# EAGLE design Quadcopter (EAGLE 5.10)

## Sheet 1 of 4
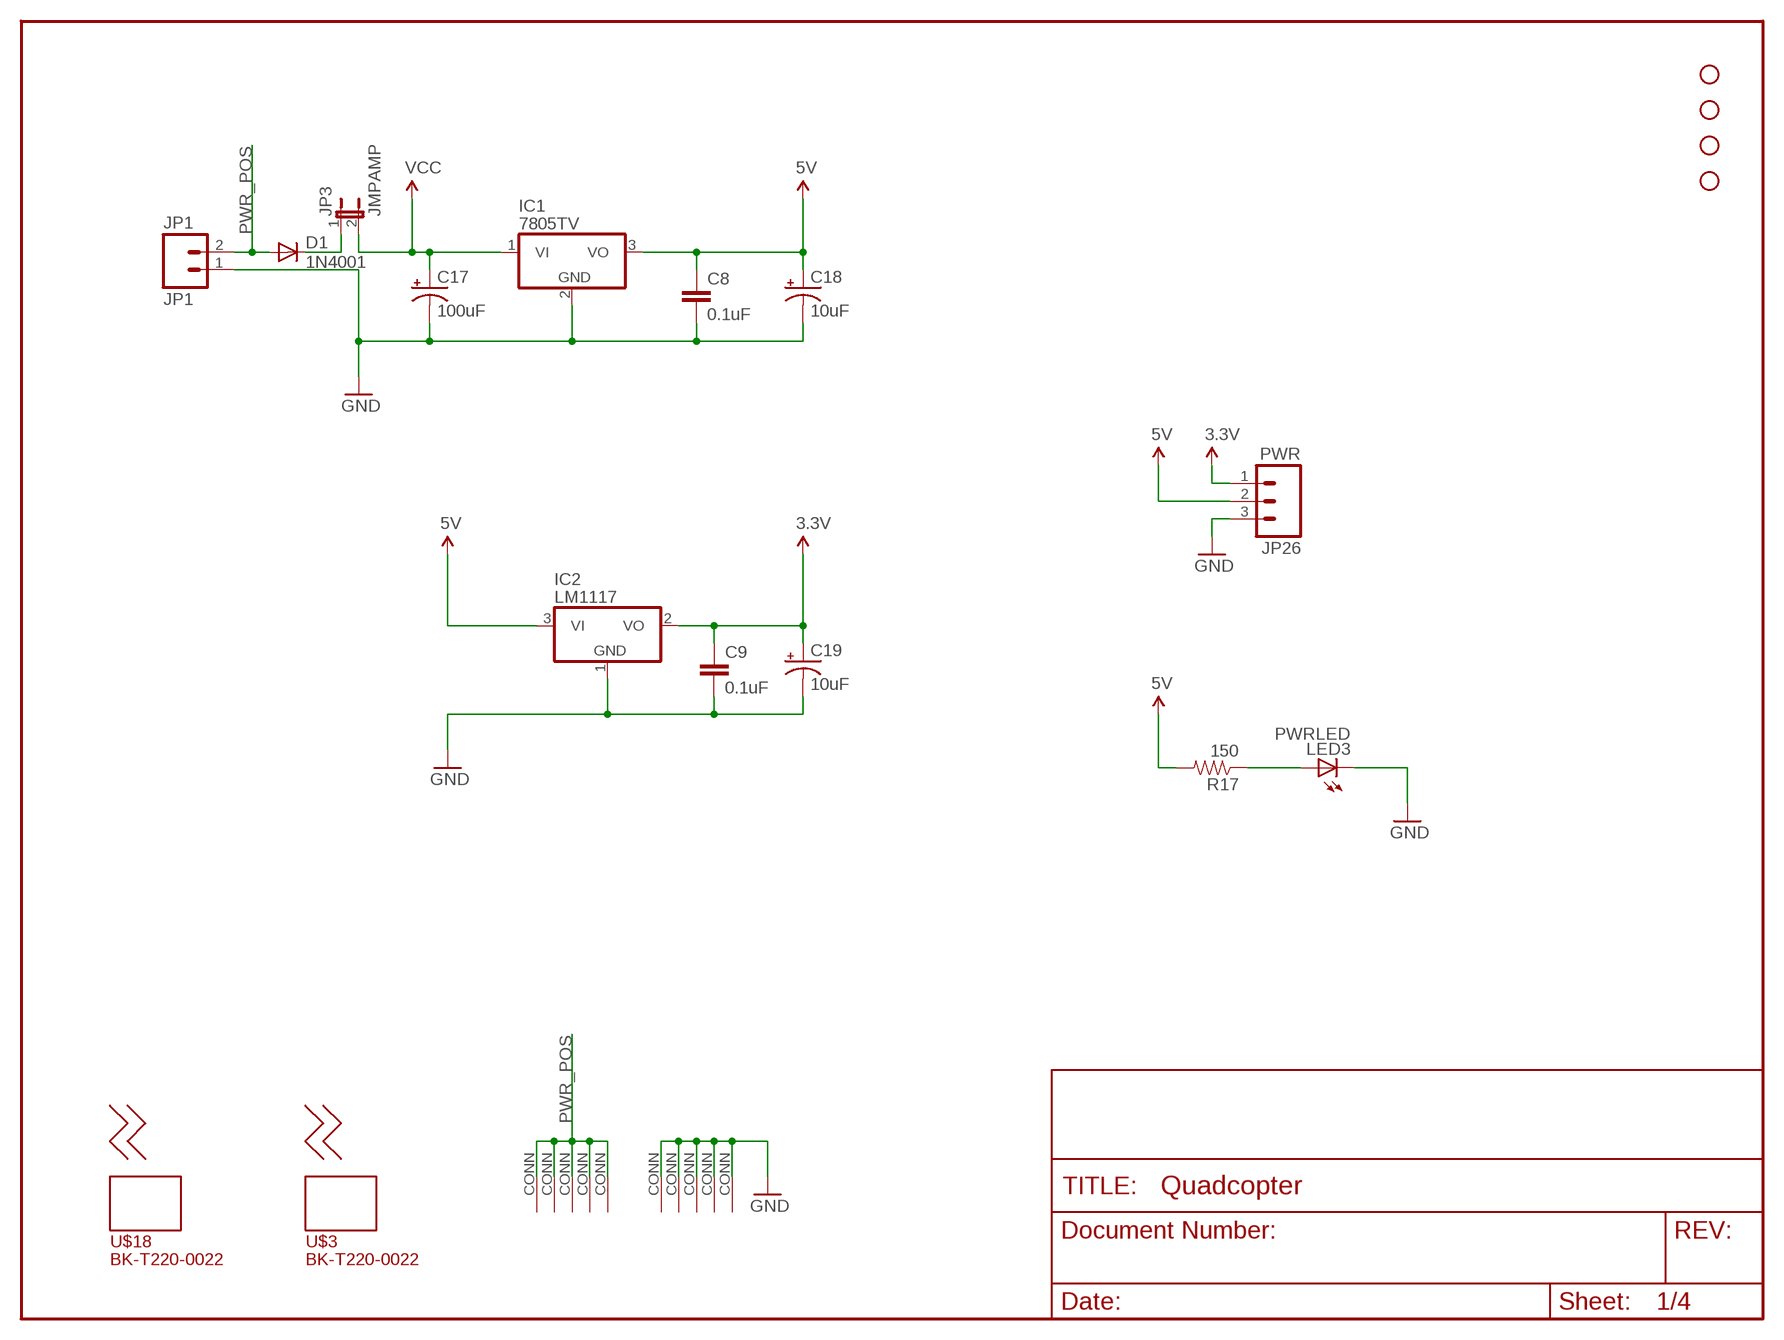
[diagram p0: schematic, sheet 1]

### Parts
C8  0.1uF  CAP1206  [1206]
C9  0.1uF  CAP1206  [1206]
C17  100uF  CPOL-USE5-8.5  [E5-8,5]
C18  10uF  CPOL-USE2-4  [E2-4]
C19  10uF  CPOL-USE2-4  [E2-4]
D1  1N4001  DIODEPTH  [DIODE-1N4001]
IC1  7805TV  [TO220V]
IC2  LM1117  [TO220V]
JP1  JP1  M023.5MM  [SCREWTERMINAL-3.5MM-2]
JP3  JMPAMP  JUMPER-2PTH  [1X02]
JP22  STAND-OFF  [STAND-OFF]
JP23  STAND-OFF  [STAND-OFF]
JP24  STAND-OFF  [STAND-OFF]
JP25  STAND-OFF  [STAND-OFF]
JP26  PWR  M03PTH  [1X03]
LED3  PWRLED  LED1206  [LED-1206]
R17  150  RESISTOR1206  [1206]
U$3  BK-T220-0022  [BK-T220-0022]
U$7  SOLDERPAD  [SOLDERPAD_3MM]
U$8  SOLDERPAD  [SOLDERPAD_3MM]
U$9  SOLDERPAD  [SOLDERPAD_3MM]
U$10  SOLDERPAD  [SOLDERPAD_3MM]
U$11  SOLDERPAD  [SOLDERPAD_3MM]
U$18  BK-T220-0022  [BK-T220-0022]
U$20  SOLDERPAD  [SOLDERPAD_3MM]
U$21  SOLDERPAD  [SOLDERPAD_3MM]
U$22  SOLDERPAD  [SOLDERPAD_3MM]
U$23  SOLDERPAD  [SOLDERPAD_3MM]
U$24  SOLDERPAD  [SOLDERPAD_3MM]

### Nets
3.3V: C9.1 C19.+ IC2.2(VO) JP26.1 ; also sheet 2,3,4
5V: C8.1 C18.+ IC1.3(VO) IC2.3(VI) JP26.2 R17.2 ; also sheet 2,3
GND: C8.2 C9.2 C17.- C18.- C19.- IC1.2(GND) IC2.1(GND) JP1.1 JP26.3 LED3.C U$20.CONN U$21.CONN U$22.CONN U$23.CONN U$24.CONN ; also sheet 2,3,4
N$10: D1.C JP3.1
N$28: LED3.A R17.1
PWR_POS: D1.A JP1.2 U$7.CONN U$8.CONN U$9.CONN U$10.CONN U$11.CONN
VCC: C17.+ IC1.1(VI) JP3.2 ; also sheet 2

## Sheet 2 of 4
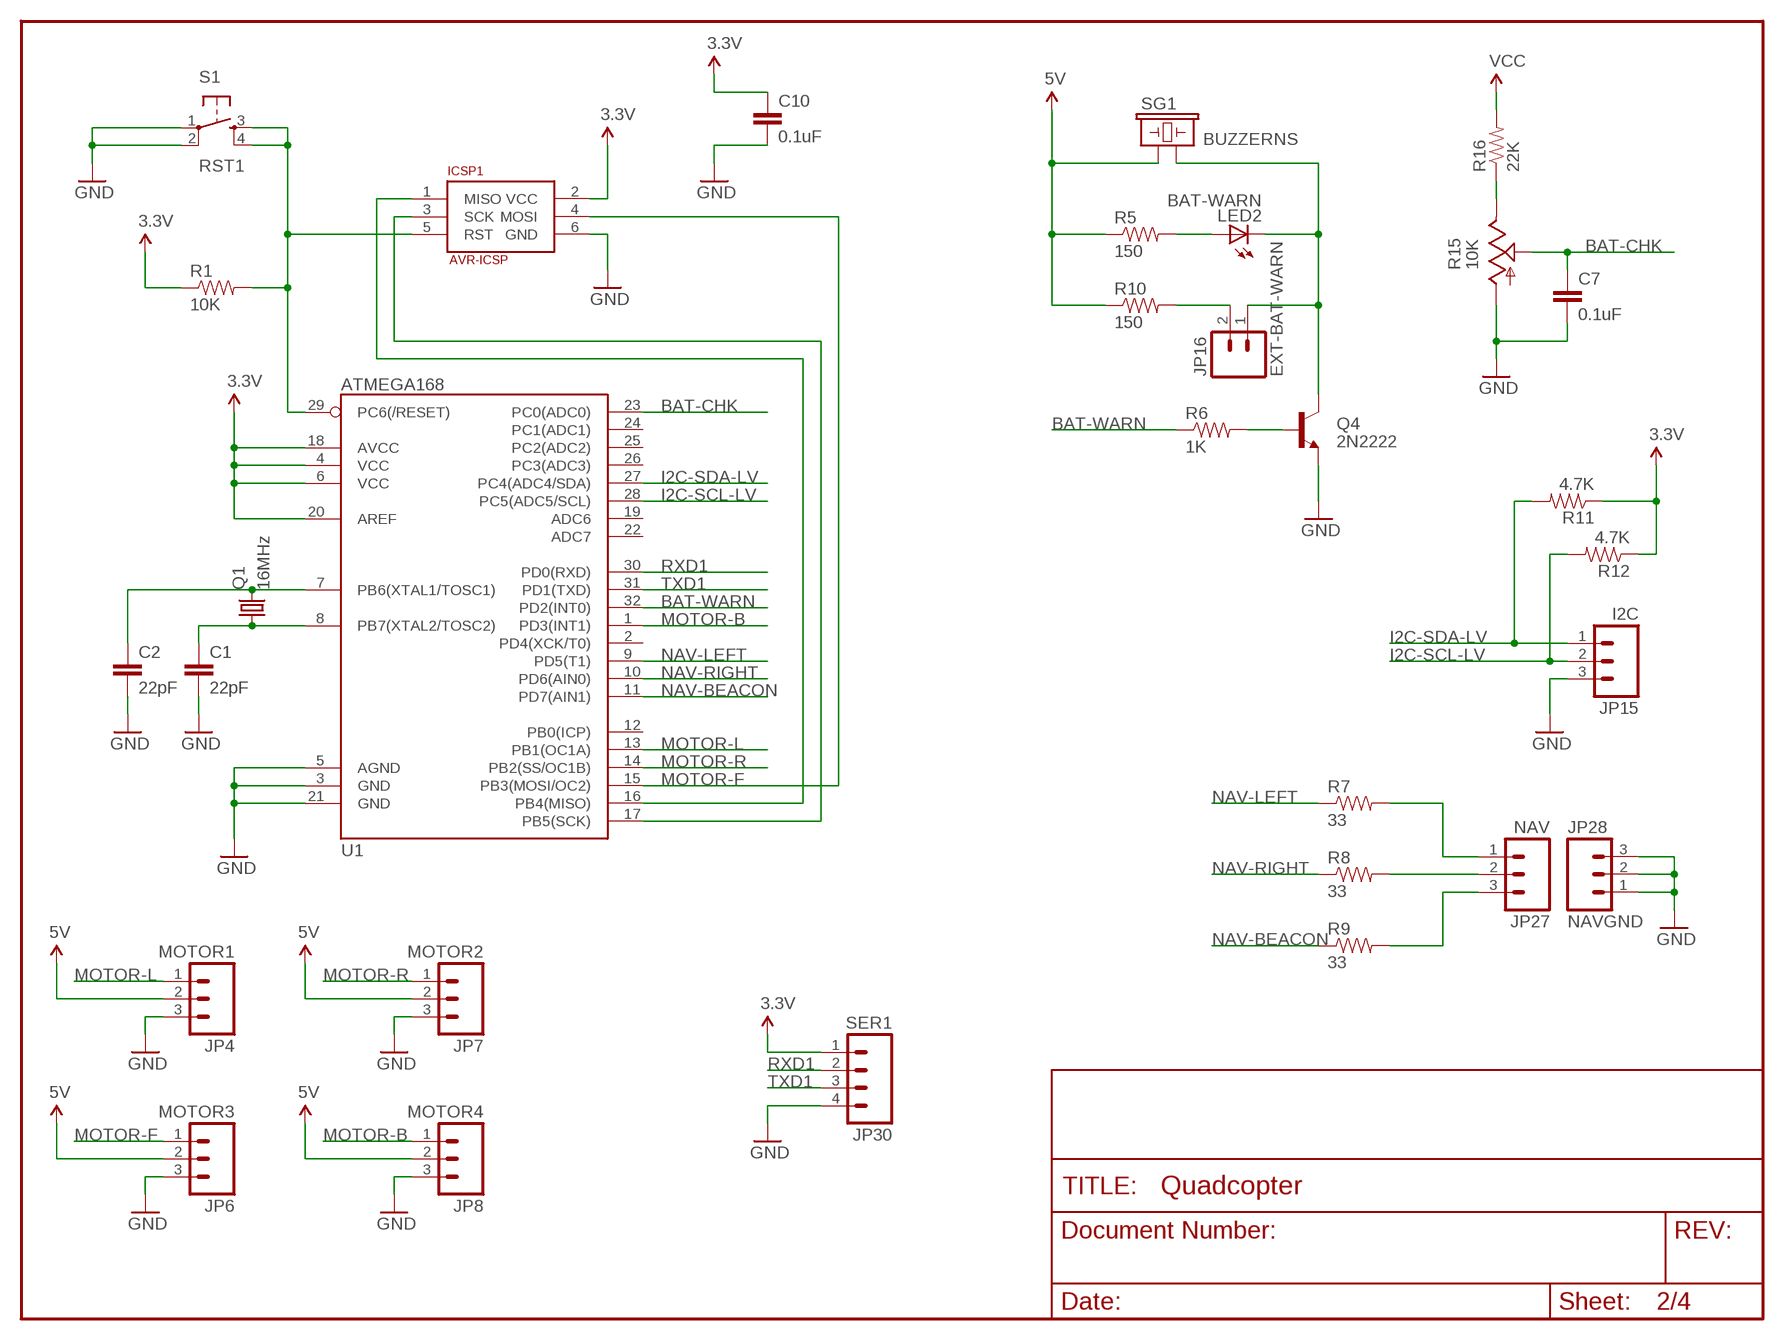
[diagram p1: schematic, sheet 2]

### Parts
C1  22pF  CAP1206  [1206]
C2  22pF  CAP1206  [1206]
C7  0.1uF  CAP1206  [1206]
C10  0.1uF  CAP1206  [1206]
ICSP1  AVR-ICSP  [AVR-ICSP]
JP4  MOTOR1  M03PTH  [1X03]
JP6  MOTOR3  M03PTH  [1X03]
JP7  MOTOR2  M03PTH  [1X03]
JP8  MOTOR4  M03PTH  [1X03]
JP15  I2C  M03PTH  [1X03]
JP16  EXT-BAT-WARN  M02PTH  [1X02]
JP27  NAV  M03PTH  [1X03]
JP28  NAVGND  M03PTH  [1X03]
JP30  SER1  M04PTH  [1X04]
LED2  BAT-WARN  LED1206  [LED-1206]
Q1  16MHz  CRYSTALHC49US  [HC49US]
Q4  2N2222  TRANSISTOR_NPNTO92  [TO-92]
R1  10K  RESISTOR1206  [1206]
R5  150  RESISTOR1206  [1206]
R6  1K  RESISTOR1206  [1206]
R7  33  RESISTOR1206  [1206]
R8  33  RESISTOR1206  [1206]
R9  33  RESISTOR1206  [1206]
R10  150  RESISTOR1206  [1206]
R11  4.7K  RESISTOR1206  [1206]
R12  4.7K  RESISTOR1206  [1206]
R15  10K  TRIM_US-B64Y  [B64Y]
R16  22K  RESISTOR1206  [1206]
S1  RST1  TAC_SWITCHPTH  [TACTILE-PTH]
SG1  BUZZERNS  [BUZZER-12MM-NS]
U1  ATMEGA168  [TQFP32-08]

### Nets
3.3V: C10.1 ICSP1.2(VCC) JP30.1 R1.1 R11.1 R12.1 U1.4(VCC) U1.6(VCC) U1.18(AVCC) U1.20(AREF) ; also sheet 1,3,4
5V: JP4.2 JP6.2 JP7.2 JP8.2 R5.1 R10.1 SG1.+ ; also sheet 1,3
BAT-CHK: C7.1 R15.S U1.23(PC0(ADC0))
BAT-WARN: R6.1 U1.32(PD2(INT0))
GND: C1.2 C2.2 C7.2 C10.2 ICSP1.6(GND) JP4.3 JP6.3 JP7.3 JP8.3 JP15.3 JP28.1 JP28.2 JP28.3 JP30.4 Q4.1(E) R15.A S1.1 S1.2 U1.3(GND) U1.5(AGND) U1.21(GND) ; also sheet 1,3,4
I2C-SCL-LV: JP15.2 R12.2 U1.28(PC5(ADC5/SCL)) ; also sheet 3,4
I2C-SDA-LV: JP15.1 R11.2 U1.27(PC4(ADC4/SDA)) ; also sheet 3,4
MOTOR-B: JP8.1 U1.1(PD3(INT1))
MOTOR-F: ICSP1.4(MOSI) JP6.1 U1.15(PB3(MOSI/OC2))
MOTOR-L: JP4.1 U1.13(PB1(OC1A))
MOTOR-R: JP7.1 U1.14(PB2(SS/OC1B))
N$1: ICSP1.5(RST) R1.2 S1.3 S1.4 U1.29(PC6(/RESET))
N$8: ICSP1.1(MISO) U1.16(PB4(MISO))
N$9: ICSP1.3(SCK) U1.17(PB5(SCK))
N$14: C2.1 Q1.2 U1.7(PB6(XTAL1/TOSC1))
N$15: C1.1 Q1.1 U1.8(PB7(XTAL2/TOSC2))
N$20: JP16.1 LED2.C Q4.3(C) SG1.-
N$21: Q4.2(B) R6.2
N$22: LED2.A R5.2
N$23: JP27.1 R7.2
N$24: JP27.2 R8.2
N$25: JP27.3 R9.2
N$26: JP16.2 R10.2
N$27: R15.E R16.1
NAV-BEACON: R9.1 U1.11(PD7(AIN1))
NAV-LEFT: R7.1 U1.9(PD5(T1))
NAV-RIGHT: R8.1 U1.10(PD6(AIN0))
RXD1: JP30.2 U1.30(PD0(RXD))
TXD1: JP30.3 U1.31(PD1(TXD))
VCC: R16.2 ; also sheet 1
Unconnected: U1.2(PD4(XCK/T0)) U1.12(PB0(ICP)) U1.19(ADC6) U1.22(ADC7) U1.24(PC1(ADC1)) U1.25(PC2(ADC2)) U1.26(PC3(ADC3))

## Sheet 3 of 4
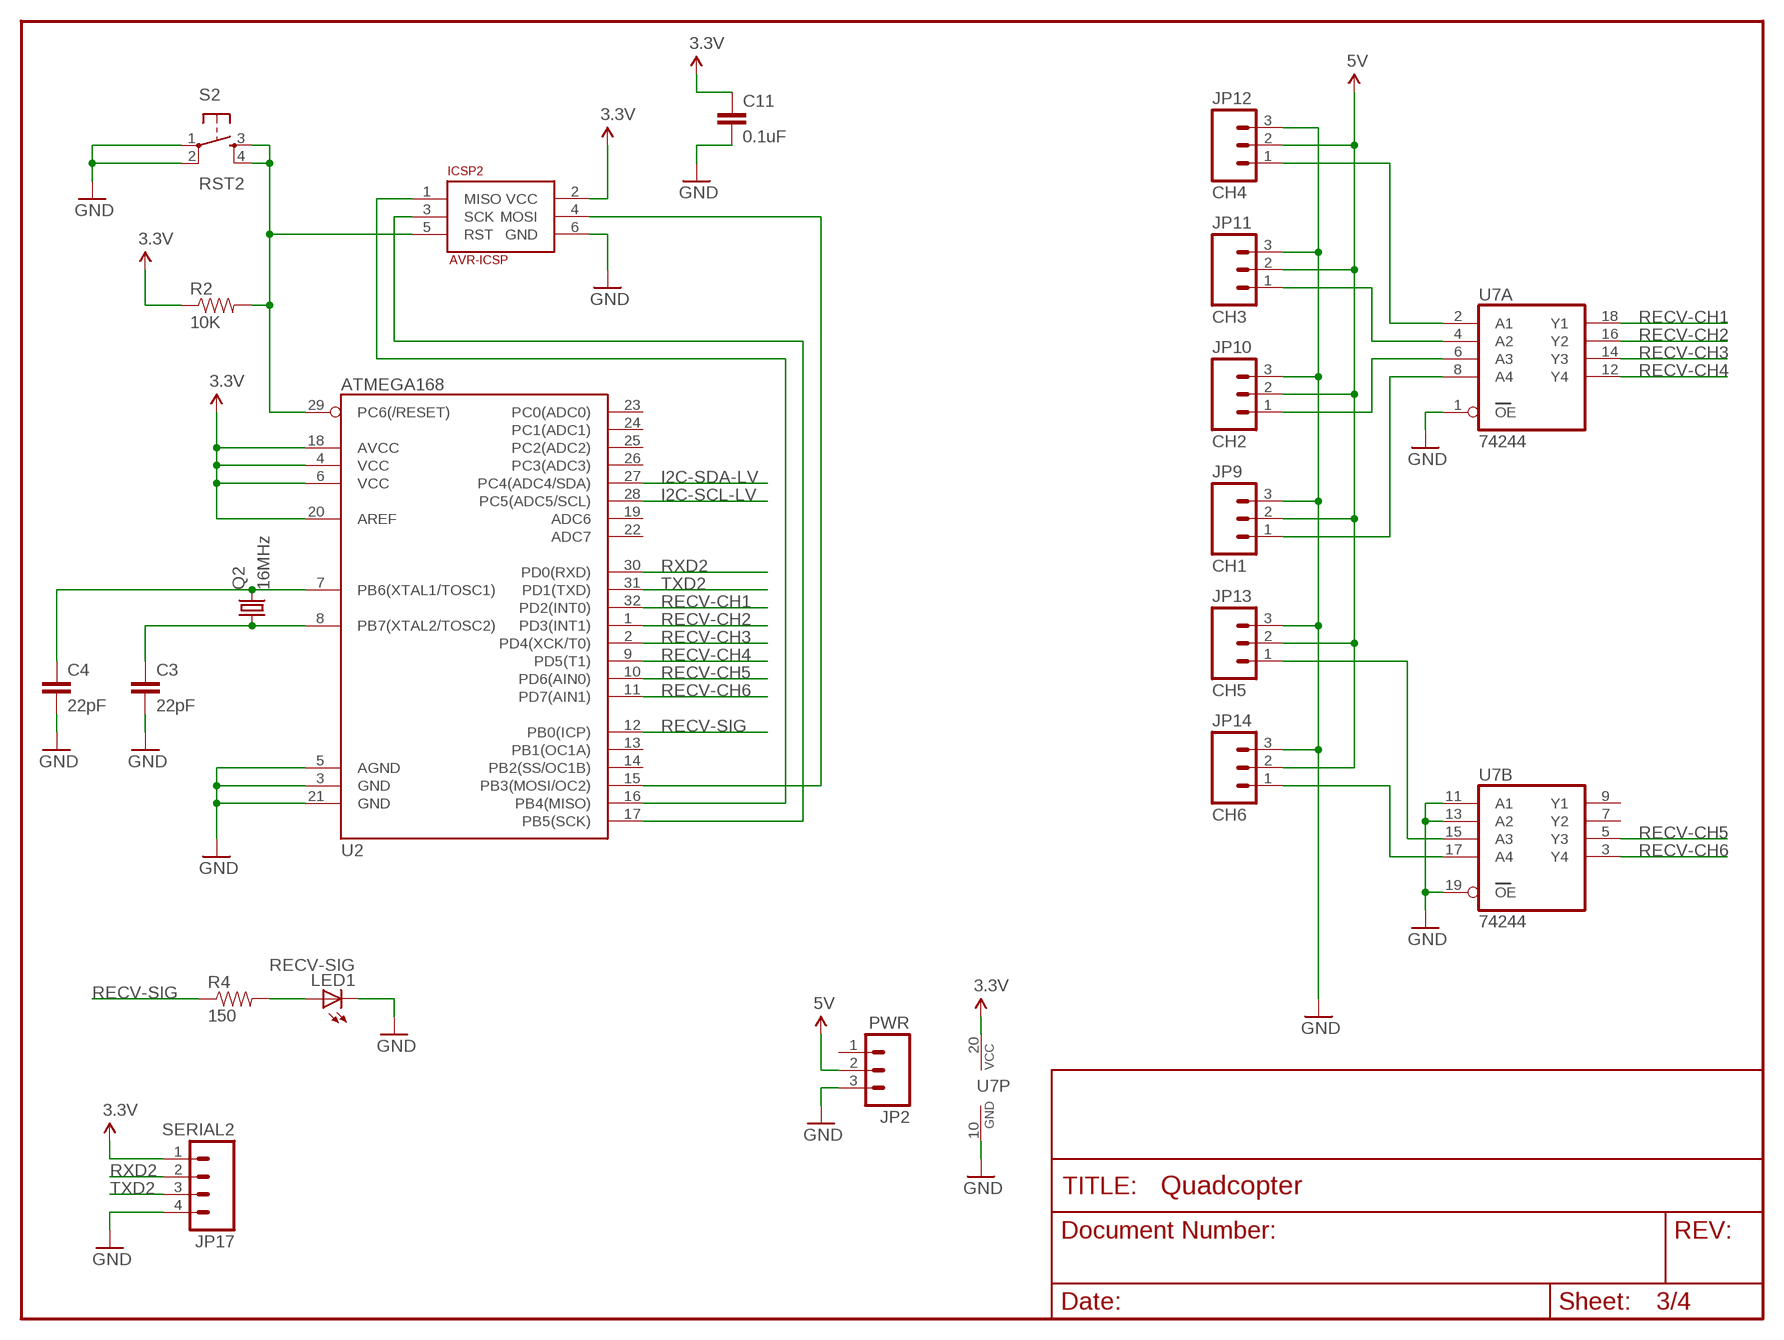
[diagram p2: schematic, sheet 3]

### Parts
C3  22pF  CAP1206  [1206]
C4  22pF  CAP1206  [1206]
C11  0.1uF  CAP1206  [1206]
ICSP2  AVR-ICSP  [AVR-ICSP]
JP2  PWR  M03PTH  [1X03]
JP9  CH1  M03PTH  [1X03]
JP10  CH2  M03PTH  [1X03]
JP11  CH3  M03PTH  [1X03]
JP12  CH4  M03PTH  [1X03]
JP13  CH5  M03PTH  [1X03]
JP14  CH6  M03PTH  [1X03]
JP17  SERIAL2  M04PTH  [1X04]
LED1  RECV-SIG  LED1206  [LED-1206]
Q2  16MHz  CRYSTALHC49US  [HC49US]
R2  10K  RESISTOR1206  [1206]
R4  150  RESISTOR1206  [1206]
S2  RST2  TAC_SWITCHPTH  [TACTILE-PTH]
U2  ATMEGA168  [TQFP32-08]
U7  74244  [TSSOP20]

### Nets
3.3V: C11.1 ICSP2.2(VCC) JP17.1 R2.1 U2.4(VCC) U2.6(VCC) U2.18(AVCC) U2.20(AREF) U7.20(P:VCC) ; also sheet 1,2,4
5V: JP2.2 JP9.2 JP10.2 JP11.2 JP12.2 JP13.2 JP14.2 ; also sheet 1,2
GND: C3.2 C4.2 C11.2 ICSP2.6(GND) JP2.3 JP9.3 JP10.3 JP11.3 JP12.3 JP13.3 JP14.3 JP17.4 LED1.C S2.1 S2.2 U2.3(GND) U2.5(AGND) U2.21(GND) U7.1(A:OE) U7.10(P:GND) U7.11(B:A1) U7.13(B:A2) U7.19(B:OE) ; also sheet 1,2,4
I2C-SCL-LV: U2.28(PC5(ADC5/SCL)) ; also sheet 2,4
I2C-SDA-LV: U2.27(PC4(ADC4/SDA)) ; also sheet 2,4
N$2: ICSP2.5(RST) R2.2 S2.3 S2.4 U2.29(PC6(/RESET))
N$6: ICSP2.1(MISO) U2.16(PB4(MISO))
N$7: ICSP2.3(SCK) U2.17(PB5(SCK))
N$11: ICSP2.4(MOSI) U2.15(PB3(MOSI/OC2))
N$13: LED1.A R4.2
N$16: C4.1 Q2.2 U2.7(PB6(XTAL1/TOSC1))
N$17: C3.1 Q2.1 U2.8(PB7(XTAL2/TOSC2))
N$29: JP9.1 U7.8(A:A4)
N$30: JP10.1 U7.6(A:A3)
N$31: JP11.1 U7.4(A:A2)
N$32: JP12.1 U7.2(A:A1)
N$33: JP13.1 U7.15(B:A3)
N$34: JP14.1 U7.17(B:A4)
RECV-CH1: U2.32(PD2(INT0)) U7.18(A:Y1)
RECV-CH2: U2.1(PD3(INT1)) U7.16(A:Y2)
RECV-CH3: U2.2(PD4(XCK/T0)) U7.14(A:Y3)
RECV-CH4: U2.9(PD5(T1)) U7.12(A:Y4)
RECV-CH5: U2.10(PD6(AIN0)) U7.5(B:Y3)
RECV-CH6: U2.11(PD7(AIN1)) U7.3(B:Y4)
RECV-SIG: R4.1 U2.12(PB0(ICP))
RXD2: JP17.2 U2.30(PD0(RXD))
TXD2: JP17.3 U2.31(PD1(TXD))
Unconnected: JP2.1 U2.13(PB1(OC1A)) U2.14(PB2(SS/OC1B)) U2.19(ADC6) U2.22(ADC7) U2.23(PC0(ADC0)) U2.24(PC1(ADC1)) U2.25(PC2(ADC2)) U2.26(PC3(ADC3)) U7.7(B:Y2) U7.9(B:Y1)

## Sheet 4 of 4
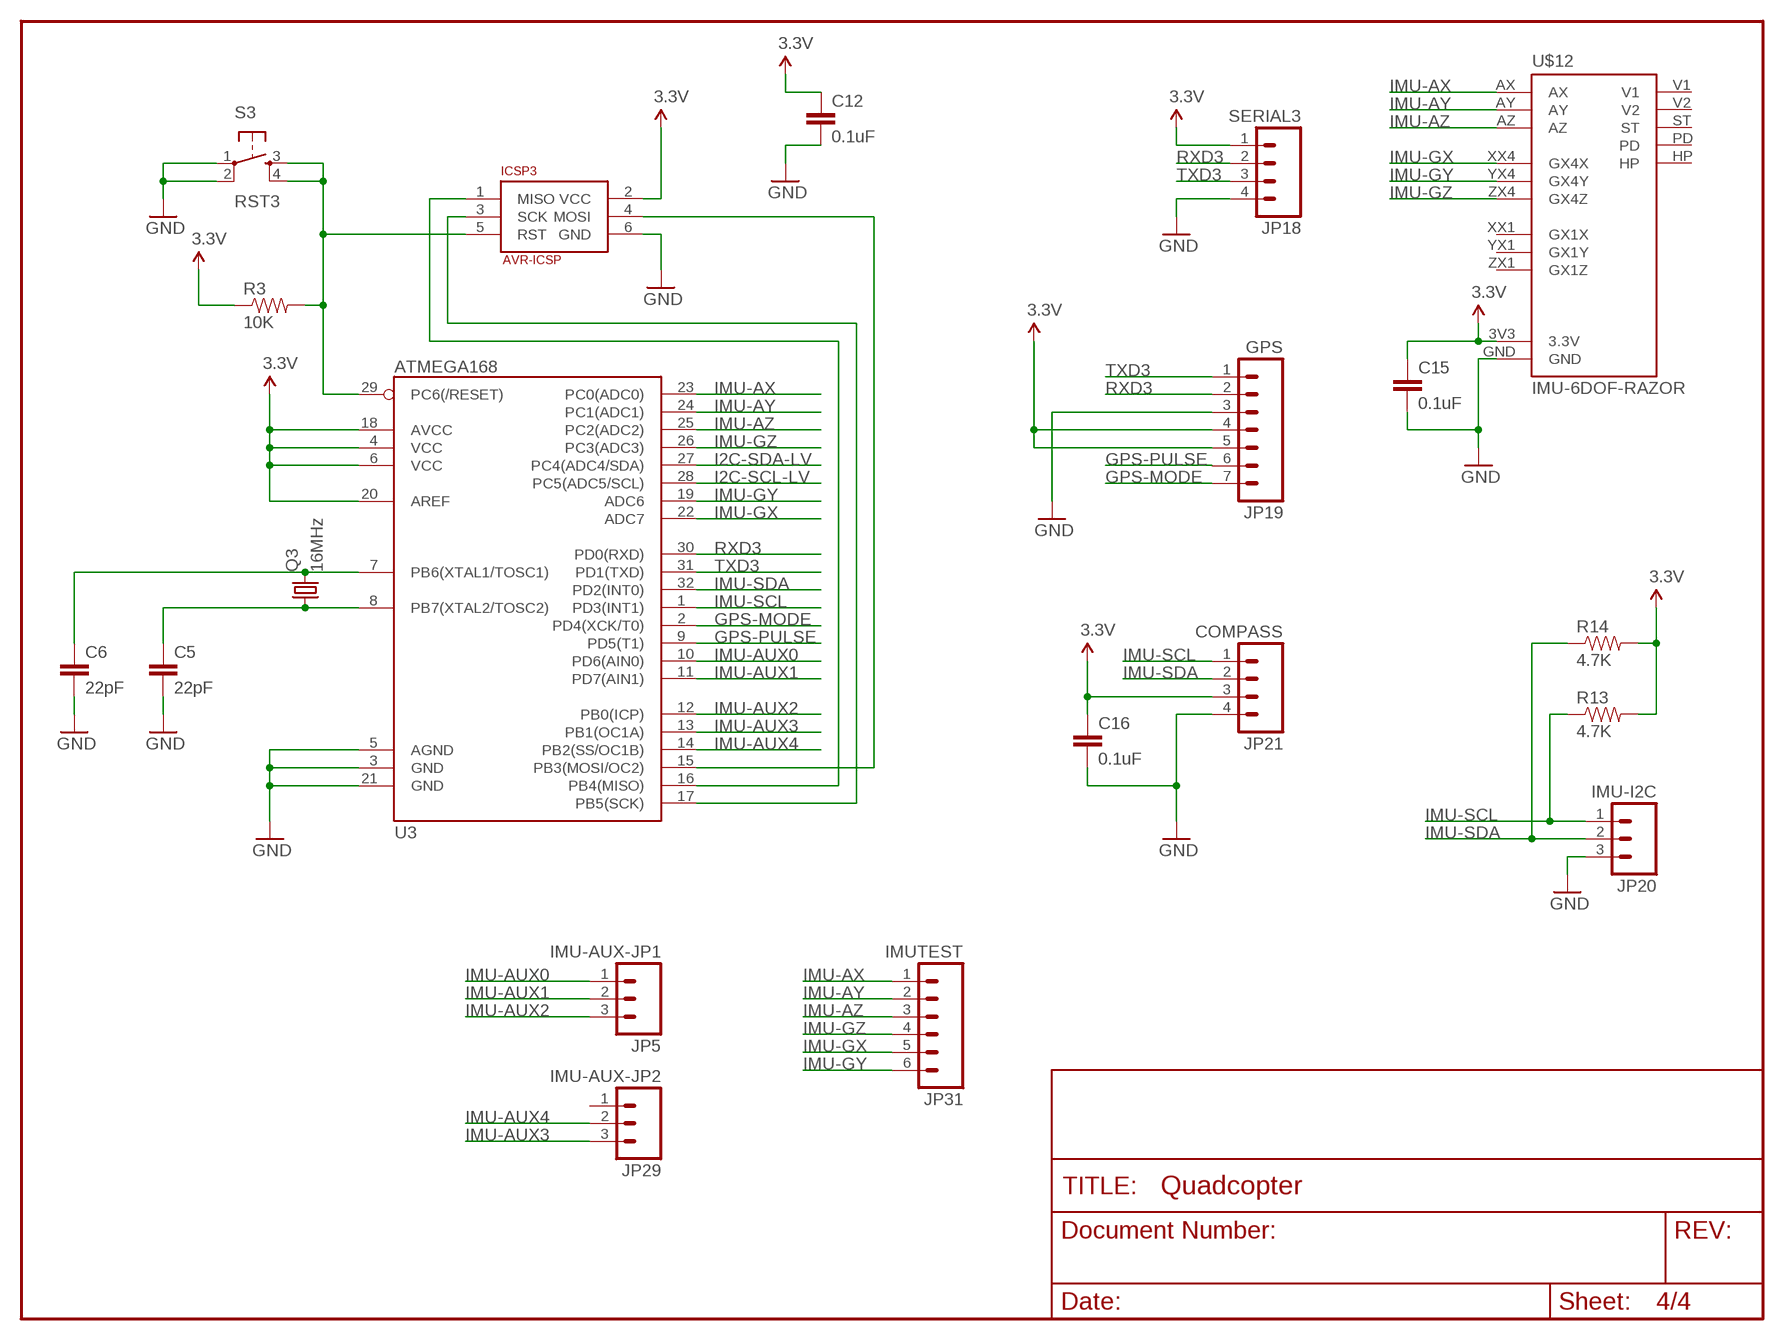
[diagram p3: schematic, sheet 4]

### Parts
C5  22pF  CAP1206  [1206]
C6  22pF  CAP1206  [1206]
C12  0.1uF  CAP1206  [1206]
C15  0.1uF  CAP1206  [1206]
C16  0.1uF  CAP1206  [1206]
ICSP3  AVR-ICSP  [AVR-ICSP]
JP5  IMU-AUX-JP1  M03PTH  [1X03]
JP18  SERIAL3  M04PTH  [1X04]
JP19  GPS  M07  [1X07]
JP20  IMU-I2C  M03PTH  [1X03]
JP21  COMPASS  M04PTH  [1X04]
JP29  IMU-AUX-JP2  M03PTH  [1X03]
JP31  IMUTEST  M06SIP  [1X06]
Q3  16MHz  CRYSTALHC49US  [HC49US]
R3  10K  RESISTOR1206  [1206]
R13  4.7K  RESISTOR1206  [1206]
R14  4.7K  RESISTOR1206  [1206]
S3  RST3  TAC_SWITCHPTH  [TACTILE-PTH]
U3  ATMEGA168  [TQFP32-08]
U$12  IMU-6DOF-RAZOR  [IMU-6DOF-RAZOR]

### Nets
3.3V: C12.1 C15.1 C16.1 ICSP3.2(VCC) JP18.1 JP19.4 JP19.5 JP21.3 R3.1 R13.2 R14.2 U3.4(VCC) U3.6(VCC) U3.18(AVCC) U3.20(AREF) U$12.3V3(3.3V) ; also sheet 1,2,3
GND: C5.2 C6.2 C12.2 C15.2 C16.2 ICSP3.6(GND) JP18.4 JP19.3 JP20.3 JP21.4 S3.1 S3.2 U3.3(GND) U3.5(AGND) U3.21(GND) U$12.GND ; also sheet 1,2,3
GPS-MODE: JP19.7 U3.2(PD4(XCK/T0))
GPS-PULSE: JP19.6 U3.9(PD5(T1))
I2C-SCL-LV: U3.28(PC5(ADC5/SCL)) ; also sheet 2,3
I2C-SDA-LV: U3.27(PC4(ADC4/SDA)) ; also sheet 2,3
IMU-AUX0: JP5.1 U3.10(PD6(AIN0))
IMU-AUX1: JP5.2 U3.11(PD7(AIN1))
IMU-AUX2: JP5.3 U3.12(PB0(ICP))
IMU-AUX3: JP29.3 U3.13(PB1(OC1A))
IMU-AUX4: JP29.2 U3.14(PB2(SS/OC1B))
IMU-AX: JP31.1 U3.23(PC0(ADC0)) U$12.AX
IMU-AY: JP31.2 U3.24(PC1(ADC1)) U$12.AY
IMU-AZ: JP31.3 U3.25(PC2(ADC2)) U$12.AZ
IMU-GX: JP31.5 U3.22(ADC7) U$12.XX4(GX4X)
IMU-GY: JP31.6 U3.19(ADC6) U$12.YX4(GX4Y)
IMU-GZ: JP31.4 U3.26(PC3(ADC3)) U$12.ZX4(GX4Z)
IMU-SCL: JP20.1 JP21.1 R13.1 U3.1(PD3(INT1))
IMU-SDA: JP20.2 JP21.2 R14.1 U3.32(PD2(INT0))
N$3: ICSP3.5(RST) R3.2 S3.3 S3.4 U3.29(PC6(/RESET))
N$4: ICSP3.1(MISO) U3.16(PB4(MISO))
N$5: ICSP3.3(SCK) U3.17(PB5(SCK))
N$12: ICSP3.4(MOSI) U3.15(PB3(MOSI/OC2))
N$18: C6.1 Q3.2 U3.7(PB6(XTAL1/TOSC1))
N$19: C5.1 Q3.1 U3.8(PB7(XTAL2/TOSC2))
RXD3: JP18.2 JP19.2 U3.30(PD0(RXD))
TXD3: JP18.3 JP19.1 U3.31(PD1(TXD))
Unconnected: JP29.1 U$12.HP U$12.PD U$12.ST U$12.V1 U$12.V2 U$12.XX1(GX1X) U$12.YX1(GX1Y) U$12.ZX1(GX1Z)

## Library data of the parts
C1-C12 C15 C16 = SparkFun:CAP: Capacitor Standard 0603 ceramic capacitor, and 0.1" leaded capacitor.
C17-C19 = rcl:CPOL-US: POLARIZED CAPACITOR, American symbol
D1 = SparkFun:DIODE: Diode These are standard reverse protection diodes and small signal diodes. SMA package can handle up to about 1A. SOD-323 can handle about 200mA. What the SOD-323 package when ordering, there are some mfgs out there that are 5-pin packages.
IC1 = linear:78*: Positive VOLTAGE REGULATOR Source: http://cache.national.com/ds/LM/LM78L05.pdf http://www.fairchildsemi.com/ds/LM/LM7805.pdf
IC2 = linear:LM1117
ICSP1-ICSP3 = Quadcopter:AVR-ICSP
JP1 JP16 = SparkFun:M02: Header 2 Standard 2-pin 0.1" header. Use with straight break away headers (SKU : PRT-00116), right angle break away headers (PRT-00553), swiss pins (PRT-00743), machine pins (PRT-00117), and female headers (PRT-00115). Molex polarized connector foot print use with SKU : PRT-08233 with associated crimp pins and housings.
JP2 JP4-JP15 JP20 JP26-JP29 = SparkFun:M03: Header 3 Standard 3-pin 0.1" header. Use with straight break away headers (SKU : PRT-00116), right angle break away headers (PRT-00553), swiss pins (PRT-00743), machine pins (PRT-00117), and female headers (PRT-00115). Molex polarized connector foot print use with SKU : PRT-08232 with associated crimp pins and housings.
JP3 = SparkFun:JUMPER-2: Jumper Basic 0.1" spaced jumper. Use with breakaway headers.
JP17 JP18 JP21 JP30 = SparkFun:M04: Header 4 Standard 4-pin 0.1" header. Use with straight break away headers (SKU : PRT-00116), right angle break away headers (PRT-00553), swiss pins (PRT-00743), machine pins (PRT-00117), and female headers (PRT-00115). Molex polarized connector foot print use with SKU : PRT-08231 with associated crimp pins and housings.
JP19 = SparkFun:M07: Header 7 Standard 7-pin 0.1" header. Use with straight break away headers (SKU : PRT-00116), right angle break away headers (PRT-00553), swiss pins (PRT-00743), machine pins (PRT-00117), and female headers (PRT-00115). NOTES ON THE VARIANTS LOCK and LOCK_LONGPADS... This footprint was designed to help hold the alignment of a through-hole component (i.e. 7-pin header) while soldering it into place. You may notice that each hole has been shifted either up or down by 0.005 of an inch from it's more standard position (which is usually a perfectly straight line). This slight alteration caused the pins (the squares in the middle) to touch the edges of the holes. Because they are alternating, it causes a "brace" to hold the header in place. 0.005 has proven to be the perfect amount of "off-center" position when using our standard breakaway headers. Although looks a little odd when you look at the bare footprint, once you have a header in there, the alteration is very hard to notice. Also, if you push a header all the way into place, it is covered up entirely on the bottom side. This idea of altering the position of holes to aid alignment will be further integrated into the Sparkfun Library for other footprints. It can help hold any component with 3 or more connection pins.
JP22-JP25 = SparkFun:STAND-OFF: Stand Off This is the mechanical footprint for a #4 phillips button head screw. Use the keepout ring to avoid running the screw head into surrounding components. SKU : PRT-00447
JP31 = SparkFun:M06: Header 6 Standard 6-pin 0.1" header. Use with straight break away headers (SKU : PRT-00116), right angle break away headers (PRT-00553), swiss pins (PRT-00743), machine pins (PRT-00117), and female headers (PRT-00115). Molex polarized connector foot print use with SKU : PRT-08094 with associated crimp pins and housings. NOTES ON THE VARIANTS LOCK and LOCK_LONGPADS... This footprint was designed to help hold the alignment of a through-hole component (i.e. 6-pin header) while soldering it into place. You may notice that each hole has been shifted either up or down by 0.005 of an inch from it's more standard position (which is a perfectly straight line). This slight alteration caused the pins (the squares in the middle) to touch the edges of the holes. Because they are alternating, it causes a "brace" to hold the component in place. 0.005 has proven to be the perfect amount of "off-center" position when using our standard breakaway headers. Although looks a little odd when you look at the bare footprint, once you have a header in there, the alteration is very hard to notice. Also, if you push a header all the way into place, it is covered up entirely on the bottom side. This idea of altering the position of holes to aid alignment will be further integrated into the Sparkfun Library for other footprints. It can help hold any component with 3 or more connection pins.
LED1-LED3 = SparkFun:LED: LEDs Standard schematic elements and footprints for 5mm, 3mm, 1206, and 0603 sized LEDs. 5mm - Spark Fun Electronics SKU : COM-00529 (and others)
Q1-Q3 = SparkFun:CRYSTAL: Crystals Various standard crystals. Proven footprints. Spark Fun Electronics SKU : COM-00534
Q4 = SparkFun:TRANSISTOR_NPN: Transistor NPN BJT configuration in SOT23 package. MMBT2222 is the common NPN we use. Double check BCE configuration again layout.
R1-R14 R16 R17 = SparkFun:RESISTOR: Resistor Basic schematic elements and footprints for 0603, 1206, and PTH 1/10th watt (small) resistors.
R15 = pot:TRIM_US-: POTENTIOMETER
S1-S3 = SparkFun:TAC_SWITCH: Momentary Switch Button commonly used for reset or general input. Spark Fun Electronics SKU : COM-00097
SG1 = SparkFun:BUZZER: Buzzer 12mm Spark Fun Electronics SKU : Comp-Buzzer
U1-U3 = SparkFun:ATMEGA168
U7 = FiveVolt:74*244
U$3 U$18 = Quadcopter:BK-T220-0022: HEATSINK, TO-220 0.75 x.38 x0.75 ,LOW PROFILE
U$7-U$11 U$20-U$24 = FiveVolt:SOLDERPAD
U$12 = Quadcopter:IMU-6DOF-RAZOR

## Board
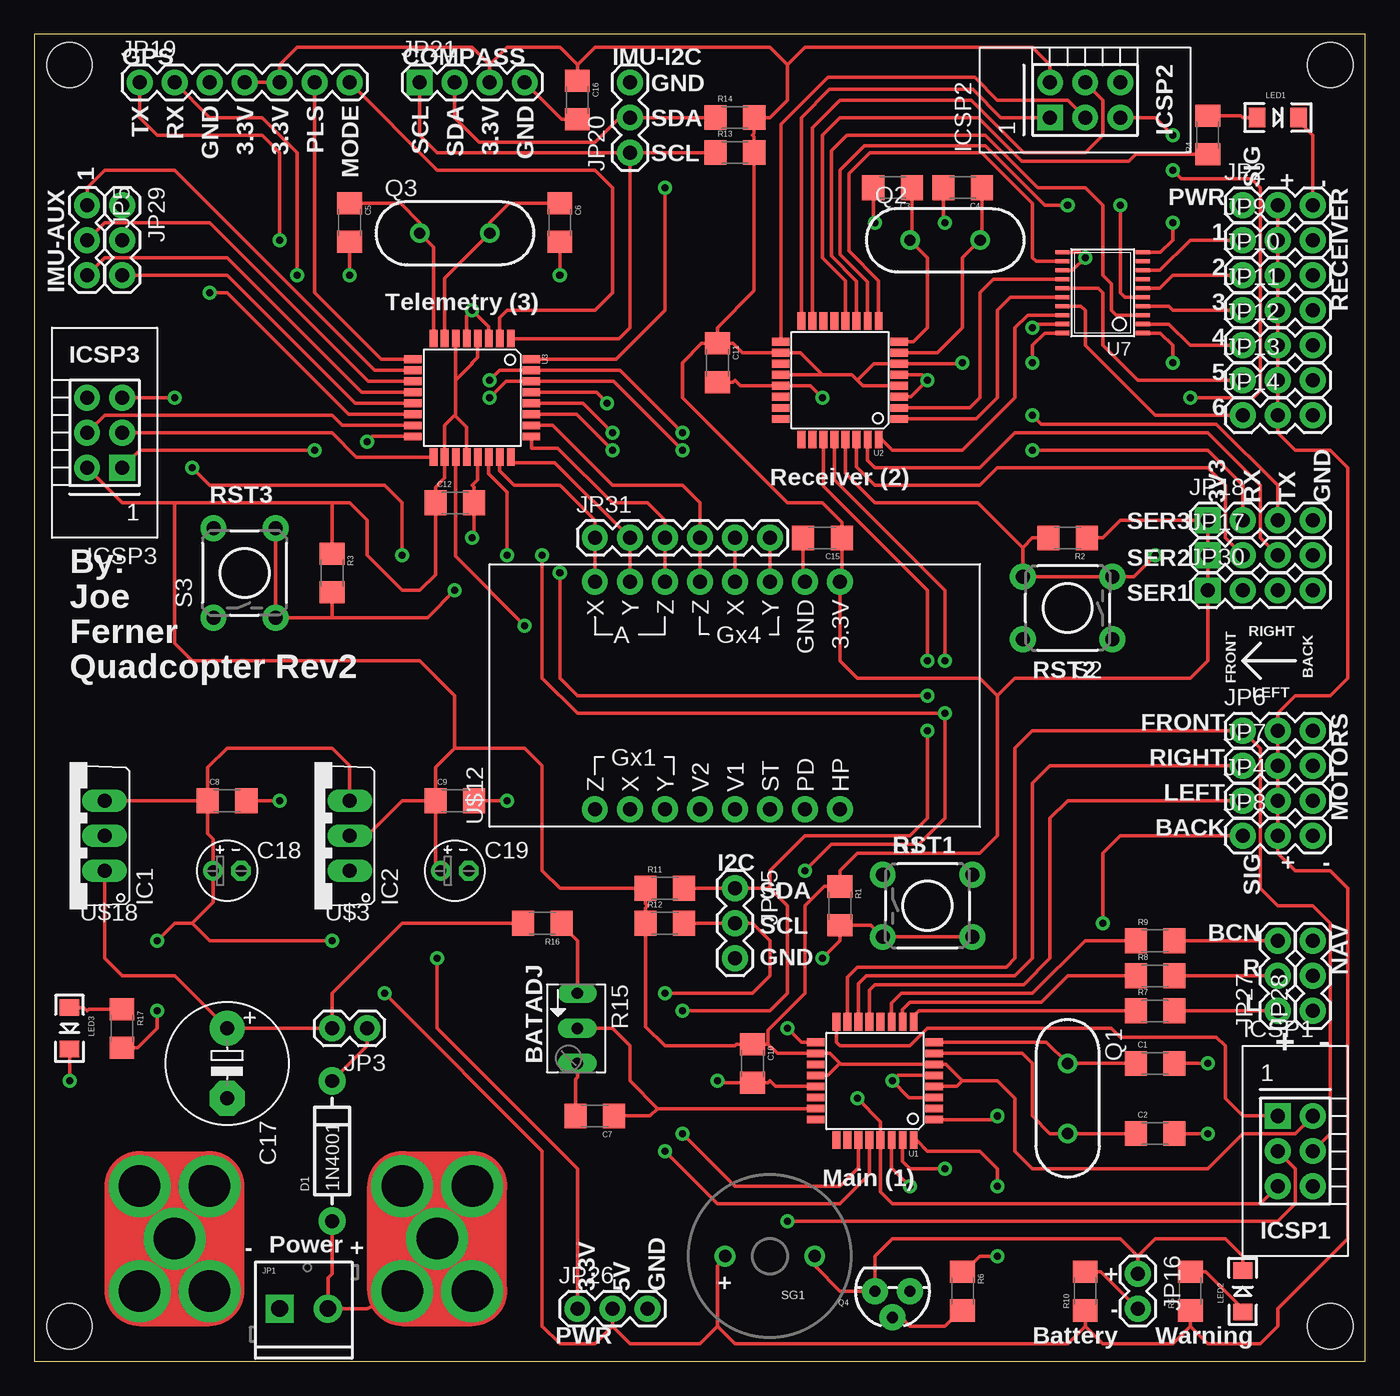
[diagram p4: board, top side]
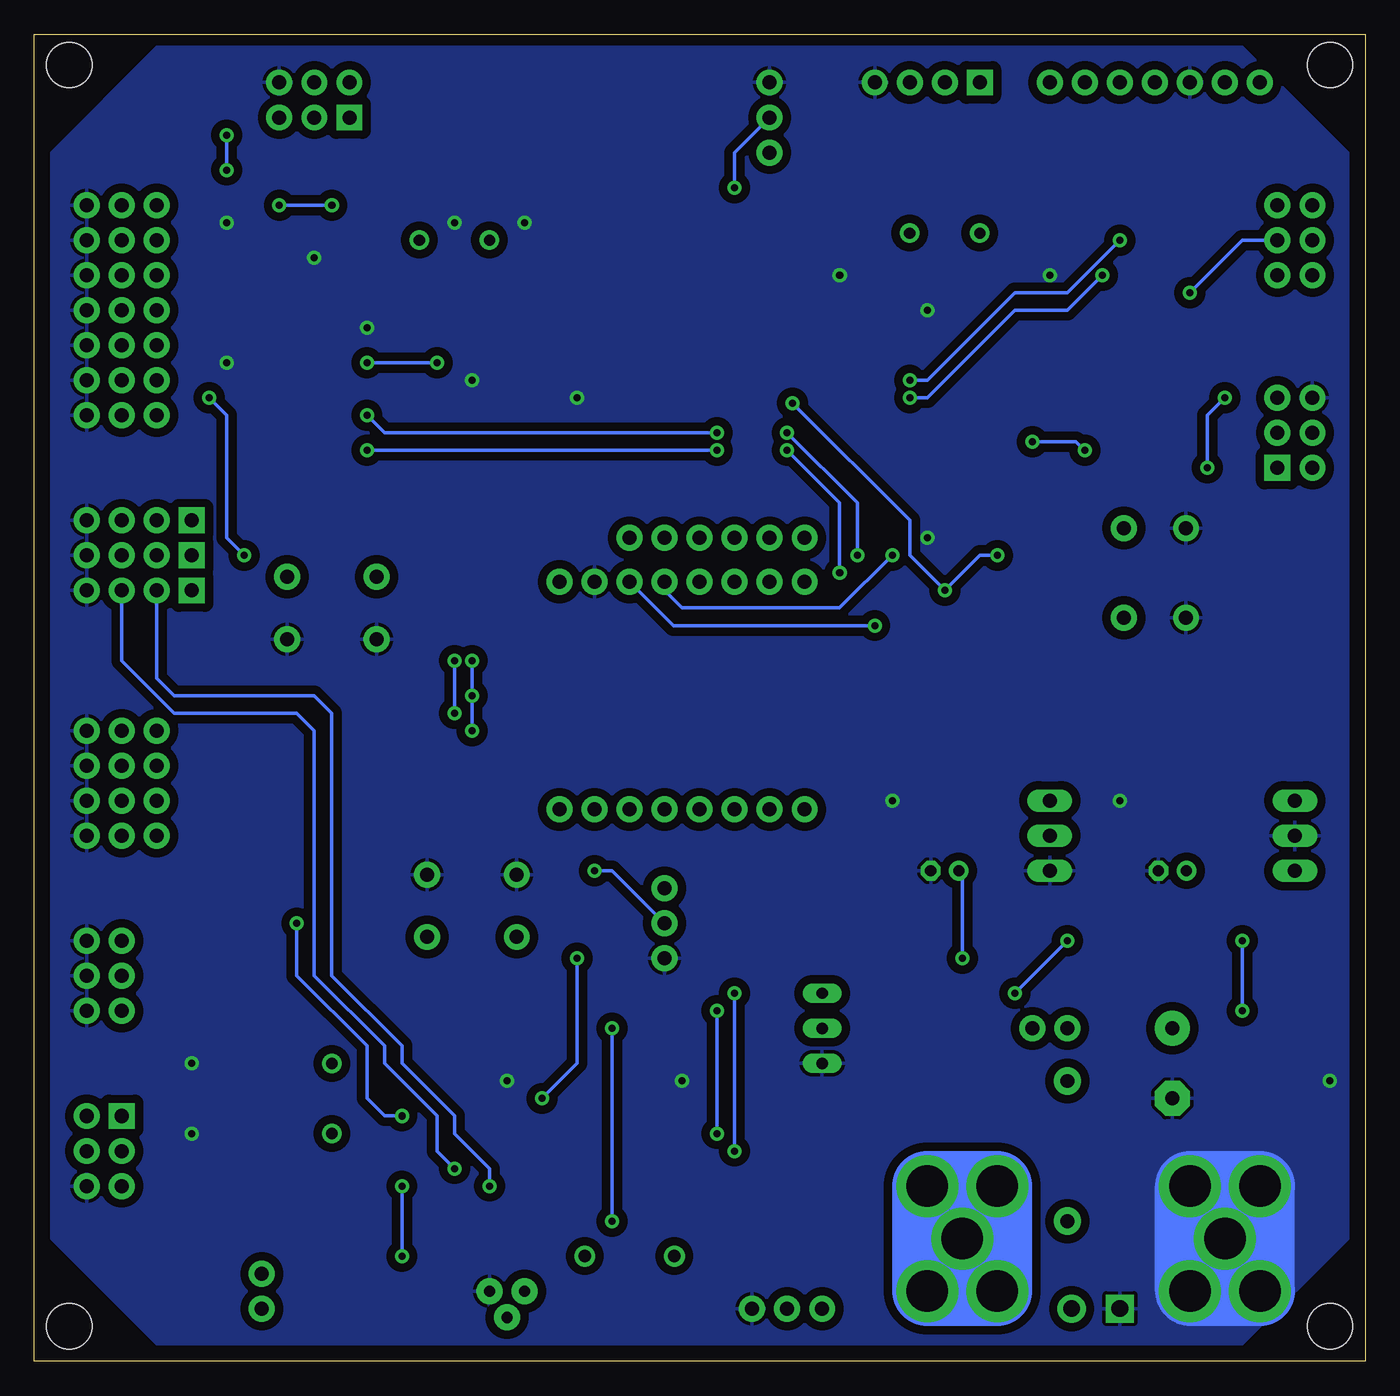
[diagram p5: board, bottom side, seen from below]

Size 96.5 x 96.19 mm. Coordinates in mm from the lower left corner, seen from the top.
Outline: 0,0 96.5,0 96.5,96.19 0,96.19 0,0
Copper layers (1*16): Top 0.035mm / dielectric 1.5mm / Bottom 0.035mm
Design rules "SparkFun": minimum track width 8mil, minimum drill 20mil, track to track 8mil, track to pad 8mil, pad to pad 8mil, via to via 8mil, smd to smd 8mil, copper to edge 10mil, drill to drill 8mil, minimum pad ring 12mil, minimum via ring 10mil, stop-mask expansion 4mil, vias tented up to drill 25mil, thermal gap 10mil

### Footprints (pad centres in the part's own frame; a part is rotated, then mirrored left to right if it is on the bottom)
1206 = smd 1.6 x 1.8: 1 -1.4,0; 2 1.4,0
E5-8,5 = drill 1.016 pad 2.54 round: + -2.54,0 | drill 1.016 pad 2.54 octagon: - 2.54,0
E2-4 = drill 0.813 pad 1.27 round: + -1.016,0 | drill 0.813 pad 1.27 octagon: - 1.016,0
DIODE-1N4001 = drill 1 pad 1.981 round: A -5.08,0; C 5.08,0
TO220V = drill 1.016 long: 1 -2.54,-2.54; 2 0,-2.54; 3 2.54,-2.54
AVR-ICSP = drill 1.016 pad 1.88 square: 1 -2.54,2.54 | drill 1.016 pad 1.88 round: 2 0,2.54; 3 -2.54,0; 4 0,0; 5 -2.54,-2.54; 6 0,-2.54
SCREWTERMINAL-3.5MM-2 = drill 1.2 pad 2.032 square: 1 0,0 | drill 1.2 pad 2.032 round: 2 3.5,0
1X03 = drill 1.016 pad 1.88 round: 1 0,0; 2 2.54,0; 3 5.08,0
1X02 = drill 1.016 pad 1.88 round: 1 0,0; 2 2.54,0
1X04 = drill 1.016 pad 1.88 square: 1 0,0 | drill 1.016 pad 1.88 round: 2 2.54,0; 3 5.08,0; 4 7.62,0
1X07 = drill 1.016 pad 1.88 round: 1 0,0; 2 2.54,0; 3 5.08,0; 4 7.62,0; 5 10.16,0; 6 12.7,0; 7 15.24,0
STAND-OFF = hole 3.302: 0,0
1X06 = drill 1.016 pad 1.88 round: 1 0,0; 2 2.54,0; 3 5.08,0; 4 7.62,0; 5 10.16,0; 6 12.7,0
LED-1206 = smd 1.2 x 1.4: A -1.5,0; C 1.5,0
HC49US = drill 0.813 round: 1 -2.54,0; 2 2.54,0
TO-92 = drill 0.813 pad 1.88 round: 1 -1.27,0; 2 0,1.905; 3 1.27,0
B64Y = drill 0.813 long: A 2.54,0; E -2.54,0; S 0,0
TACTILE-PTH = drill 1.016 pad 1.88 round: 1 -3.251,2.261; 2 3.251,2.261; 3 -3.251,-2.261; 4 3.251,-2.261
BUZZER-12MM-NS = drill 0.9 round: + 3.25,0; - -3.25,0
TQFP32-08 = smd 1.27 x 0.559: 1 -4.293,2.8; 2 -4.293,2; 3 -4.293,1.2; 4 -4.293,0.4; 5 -4.293,-0.4; 6 -4.293,-1.2; 7 -4.293,-2; 8 -4.293,-2.8; 17 4.293,-2.8; 18 4.293,-2; 19 4.293,-1.2; 20 4.293,-0.4; 21 4.293,0.4; 22 4.293,1.2; 23 4.293,2; 24 4.293,2.8 | smd 0.559 x 1.27: 9 -2.8,-4.293; 10 -2,-4.293; 11 -1.2,-4.293; 12 -0.4,-4.293; 13 0.4,-4.293; 14 1.2,-4.293; 15 2,-4.293; 16 2.8,-4.293; 25 2.8,4.293; 26 2,4.293; 27 1.2,4.293; 28 0.4,4.293; 29 -0.4,4.293; 30 -1.2,4.293; 31 -2,4.293; 32 -2.8,4.293
TSSOP20 = smd 0.305 x 0.991: 1 -2.925,-2.918; 2 -2.275,-2.918; 3 -1.625,-2.918; 4 -0.975,-2.918; 5 -0.325,-2.918; 6 0.325,-2.918; 7 0.975,-2.918; 8 1.625,-2.918; 9 2.275,-2.918; 10 2.925,-2.918; 11 2.925,2.918; 12 2.275,2.918; 13 1.625,2.918; 14 0.975,2.918; 15 0.325,2.918; 16 -0.325,2.918; 17 -0.975,2.918; 18 -1.625,2.918; 19 -2.275,2.918; 20 -2.925,2.918
SOLDERPAD_3MM = drill 3 pad 4.5 round: CONN 0,0
IMU-6DOF-RAZOR = drill 1.016 pad 1.88 round: 3V3 8.255,-8.89; AX 8.255,8.89; AY 8.255,6.35; AZ 8.255,3.81; GND 8.255,-6.35; HP -8.255,-8.89; PD -8.255,-6.35; ST -8.255,-3.81; V1 -8.255,-1.27; V2 -8.255,1.27; XX1 -8.255,6.35; XX4 8.255,-1.27; YX1 -8.255,3.81; YX4 8.255,-3.81; ZX1 -8.255,8.89; ZX4 8.255,1.27

### Placement (x,y rotation side)
C1  81.28,21.59 0 top
C2  81.28,16.51 0 top
C3  62.23,85.09 180 top
C4  67.31,85.09 180 top
C5  22.86,82.55 270 top
C6  38.1,82.55 270 top
C7  40.64,17.78 180 top
C8  13.97,40.64 0 top
C9  30.48,40.64 0 top
C10  52.07,21.59 270 top
C11  49.53,72.39 270 top
C12  30.48,62.23 0 top
C15  57.15,59.69 180 top
C16  39.37,91.44 270 top
C17  13.97,21.59 270 top
C18  13.97,35.56 0 top
C19  30.48,35.56 0 top
D1  21.59,15.24 90 top
IC1  2.54,38.1 90 top
IC2  20.32,38.1 90 top
ICSP1  92.71,15.24 0 top
ICSP2  76.2,92.71 90 top
ICSP3  3.81,67.31 180 top
JP1  17.78,3.81 0 top
JP2  87.63,83.82 0 top
JP3  24.13,24.13 180 top
JP4  87.63,40.64 0 top
JP5  3.81,83.82 270 top
JP6  87.63,45.72 0 top
JP7  87.63,43.18 0 top
JP8  87.63,38.1 0 top
JP9  87.63,81.28 0 top
JP10  87.63,78.74 0 top
JP11  87.63,76.2 0 top
JP12  87.63,73.66 0 top
JP13  87.63,71.12 0 top
JP14  87.63,68.58 0 top
JP15  50.8,34.29 270 top
JP16  80.01,6.35 270 top
JP17  85.09,58.42 0 top
JP18  85.09,60.96 0 top
JP19  7.62,92.71 0 top
JP20  43.18,87.63 90 top
JP21  27.94,92.71 0 top
JP22  2.54,2.54 0 top
JP23  93.98,2.54 0 top
JP24  93.98,93.98 0 top
JP25  2.54,93.98 0 top
JP26  39.37,3.81 0 top
JP27  90.17,25.4 90 top
JP28  92.71,25.4 90 top
JP29  6.35,83.82 270 top
JP30  85.09,55.88 0 top
JP31  40.64,59.69 0 top
LED1  90.17,90.17 0 top
LED2  87.63,5.08 90 top
LED3  2.54,24.13 270 top
Q1  74.93,19.05 270 top
Q2  66.04,81.28 0 top
Q3  30.48,81.79 0 top
Q4  62.23,5.08 180 top
R1  58.42,33.02 270 top
R2  74.93,59.69 180 top
R3  21.59,57.15 270 top
R4  85.09,88.9 90 top
R5  83.82,5.08 90 top
R6  67.31,5.08 270 top
R7  81.28,25.4 0 top
R8  81.28,27.94 0 top
R9  81.28,30.48 0 top
R10  76.2,5.08 90 top
R11  45.72,34.29 0 top
R12  45.72,31.75 0 top
R13  50.8,87.63 0 top
R14  50.8,90.17 0 top
R15  39.37,24.13 270 top
R16  36.83,31.75 180 top
R17  6.35,24.13 270 top
S1  64.77,33.02 0 top
S2  74.93,54.61 180 top
S3  15.24,57.15 90 top
SG1  53.34,7.62 180 top
U1  60.96,20.32 180 top
U2  58.42,71.12 180 top
U3  31.75,69.85 270 top
U7  77.47,77.47 90 top
U$3  19.05,27.94 0 top
U$7  29.21,8.89 180 top
U$8  26.67,12.7 180 top
U$9  26.67,5.08 180 top
U$10  31.75,5.08 180 top
U$11  31.75,12.7 180 top
U$12  49.53,48.26 90 top
U$18  1.27,27.94 0 top
U$20  10.16,8.89 0 top
U$21  7.62,5.08 0 top
U$22  12.7,12.7 0 top
U$23  7.62,12.7 0 top
U$24  12.7,5.08 0 top

### Tracks (layer width: path | path; a pad name or v marks a point on that pad's centre or on a via)
3.3V  (via drill 0.51)
  Top 0.254: C9.1 26.67,40.64 24.13,38.1 IC2.2 | C9.1 29.08,35.94 C19.+ | 53.21,22.99 C10.1 50.93,22.99 50.8,22.86 45.72,22.86 44.32,24.26 R12.1 44.32,32.89 44.45,33.02 44.32,33.15 R11.1 38.1,34.29 36.83,35.56 36.83,43.18 35.56,44.45 30.48,44.45 | 53.21,22.99 53.88,22.32 U1.18 57.69,22.32 58.42,21.59 | U1.20 57.55,20.72 58.42,21.59 | 58.42,21.59 58.49,21.52 U1.6 66.11,21.52 67.31,20.32 | U1.4 66.91,19.92 67.31,20.32 | C9.1 29.08,43.05 30.48,44.45 | 53.21,22.99 53.21,24 55.88,26.67 55.88,33.02 57.28,34.42 R1.1 58.42,35.56 59.69,36.83 68.58,36.83 69.85,38.1 69.85,48.26 | 67.31,20.32 69.85,20.32 71.12,19.05 71.12,15.24 72.39,13.97 85.09,13.97 87.63,16.51 91.44,16.51 ICSP1.2 | R2.1 77.47,59.69 78.74,60.96 JP18.1 JP17.1 JP30.1 85.09,50.8 83.82,49.53 71.12,49.53 69.85,48.26 | ICSP2.2 73.66,93.98 72.39,95.25 55.88,95.25 54.61,93.98 | 54.61,93.98 54.61,91.44 53.34,90.17 R14.2 52.2,89.03 52.07,88.9 52.2,88.77 R13.2 52.2,77.6 49.53,74.93 C11.1 | 33.02,93.98 34.29,95.25 38.1,95.25 39.37,93.98 | 54.61,93.98 53.34,95.25 40.64,95.25 39.37,93.98 | 39.37,93.98 C16.1 | 33.02,93.98 JP21.3 | 33.02,93.98 31.75,95.25 19.05,95.25 17.78,93.98 JP19.5 JP19.4 | 59.69,71.12 60.89,72.32 U2.6 67.24,72.32 v67.31,72.39 | U2.4 60.09,70.72 59.69,71.12 | 57.15,71.52 U2.20 | 57.15,71.52 59.29,71.52 59.69,71.12 | 57.15,71.52 55.55,73.12 U2.18 51.34,73.12 50.67,73.79 C11.1 | U7.20 73.28,74.55 72.39,73.66 v72.39,72.39 | C11.1 48.39,73.79 46.99,72.39 46.99,69.85 54.61,62.23 57.15,62.23 58.55,60.83 C15.1 58.55,56.65 U$12.3V3 58.42,50.8 59.69,49.53 68.58,49.53 69.85,48.26 | U3.20 31.35,67.71 30.48,68.58
  Top 0.254: 30.48,68.58 29.75,67.85 U3.18 29.75,64.04 29.08,63.37 C12.1 29.08,57.02 27.94,55.88 26.67,55.88 24.13,58.42 24.13,60.96 22.86,62.23 21.59,62.23 | 30.55,71.12 30.55,68.65 30.48,68.58 | 30.55,71.12 U3.6 | U3.4 32.15,72.79 31.75,72.39 31.75,72.32 30.55,71.12 | ICSP3.2 6.35,62.23 10.16,62.23 | 10.16,62.23 21.59,62.23 | 21.59,62.23 R3.1 | 30.48,44.45 30.48,48.26 27.94,50.8 11.43,50.8 10.16,52.07 10.16,62.23 | v29.21,29.21 29.21,24.13 39.37,13.97 JP26.1
  Bottom 0.254: v67.31,72.39 v72.39,72.39 | v29.21,29.21 29.21,35.31 C19.+
5V  (via drill 0.51)
  Top 0.254: C8.1 12.57,38.23 12.95,37.85 C18.+ 12.95,33.27 11.43,31.75 | C8.1 IC1.3 | C8.1 12.57,43.05 13.97,44.45 21.59,44.45 22.86,43.18 IC2.3 | 76.2,2.54 74.93,1.27 50.8,1.27 49.53,2.54 | 76.2,2.54 R10.1 | 76.2,2.54 77.47,1.27 82.55,1.27 83.82,2.54 | 83.82,2.54 R5.1 | 83.82,2.54 85.09,1.27 88.9,1.27 90.17,2.54 90.17,3.81 95.25,8.89 95.25,34.29 93.98,35.56 91.44,35.56 90.17,36.83 JP8.2 JP4.2 JP7.2 JP6.2 90.17,46.99 91.44,48.26 93.98,48.26 95.25,49.53 95.25,64.77 93.98,66.04 91.44,66.04 90.17,67.31 JP14.2 JP13.2 JP12.2 JP11.2 JP10.2 JP9.2 JP2.2 | 49.53,2.54 49.53,6.91 SG1.+ | 11.43,31.75 10.16,31.75 v8.89,30.48 | v8.89,25.4 8.89,24.13 7.49,22.73 R17.2 | 41.91,2.54 43.18,1.27 48.26,1.27 49.53,2.54 | 41.91,2.54 JP26.2 | 41.91,2.54 40.64,1.27 38.1,1.27 36.83,2.54 36.83,15.24 v25.4,26.67 | v21.59,30.48 12.7,30.48 11.43,31.75
  Bottom 0.254: v21.59,30.48 v25.4,26.67 | v8.89,25.4 v8.89,30.48
BAT-CHK
  Top 0.254: 45.18,18.32 U1.23 | 45.18,18.32 43.18,20.32 43.18,22.86 41.91,24.13 R15.S | C7.1 44.64,17.78 45.18,18.32
BAT-WARN  (via drill 0.51)
  Top 0.254: U1.32 63.98,16.03 64.77,15.24 68.58,15.24 69.85,13.97 v69.85,12.7 | R6.1 67.44,6.48 68.58,7.62 v69.85,7.62
  Bottom 0.254: v69.85,7.62 v69.85,12.7
GND  (via drill 0.51)
  Top 0.254: C8.2 v17.78,40.64 | C9.2 v34.29,40.64 | C1.2 v85.09,21.59 | C2.2 v85.09,16.51 | U1.21 53.74,19.92 53.34,20.32 53.21,20.19 C10.2 49.66,20.19 v49.53,20.32 | U1.5 62.63,20.72 v62.23,20.32 63.43,19.12 U1.3 | U7.1 81.67,74.55 82.55,73.66 v82.55,72.39 | U7.10 81.67,80.39 82.55,81.28 v82.55,82.55 | LED1.C 91.67,89.94 92.71,88.9 JP2.3 | C16.2 38.23,90.04 JP21.4 | C3.2 60.83,82.68 v60.96,82.55 | C4.2 65.91,82.68 v66.04,82.55 | U2.5 64.37,71.52 v64.77,71.12 63.57,69.92 U2.3 | v57.15,69.85 56.28,70.72 U2.21 51.2,70.72 50.8,71.12 50.67,70.99 C11.2 | U7.11 75.81,80.39 v76.2,80.01 75.28,79.09 U7.13 | U7.19 72.66,75.19 v72.39,74.93 | C15.2 55.75,56.65 U$12.GND | U3.5 31.35,75.8 v31.75,76.2 32.95,75 U3.3 | v31.75,59.69 31.88,59.82 C12.2 31.88,63.37 31.75,63.5 32.15,63.9 U3.21 | C5.2 v22.86,78.74 | C6.2 v38.1,78.74 | C7.2 39.24,20.45 39.37,20.58 R15.A | LED3.C v2.54,20.32
  Top 5.08: U$21.CONN U$20.CONN | U$20.CONN U$22.CONN | U$20.CONN U$23.CONN | U$20.CONN U$24.CONN | U$21.CONN U$24.CONN | U$21.CONN U$23.CONN | U$23.CONN U$22.CONN | U$24.CONN U$22.CONN
  Bottom 5.08: U$20.CONN U$23.CONN | U$20.CONN U$22.CONN | U$20.CONN U$24.CONN | U$21.CONN U$20.CONN | U$21.CONN U$24.CONN | U$24.CONN U$22.CONN | U$23.CONN U$22.CONN | U$21.CONN U$23.CONN
  pour Bottom (isolate 0.61): 1.27,87.63 8.89,95.25 87.63,95.25 95.25,87.63 95.25,8.89 87.63,1.27 8.89,1.27 1.27,8.89
GPS-MODE
  Top 0.254: U3.2 33.75,75.66 34.29,76.2 40.64,76.2 41.91,77.47 41.91,85.09 40.64,86.36 29.21,86.36 JP19.7
GPS-PULSE
  Top 0.254: U3.9 25.14,72.65 20.32,77.47 JP19.6
I2C-SCL-LV  (via drill 0.51)
  Top 0.254: U1.28 60.56,13.57 58.42,11.43 49.53,11.43 v45.72,15.24 | R12.2 JP15.2 52.07,31.75 53.34,30.48 53.34,27.94 52.07,26.67 v45.72,26.67 | U2.28 58.02,63.9 66.04,55.88 v66.04,50.8 | U3.28 39.77,69.45 v41.91,67.31 | v36.83,58.42 36.83,49.53 39.37,46.99 v66.04,46.99 66.04,39.37 64.14,37.47 57.78,37.47 v55.88,35.56
  Bottom 0.254: v45.72,15.24 v45.72,26.67 | v36.83,58.42 36.83,62.23 v41.91,67.31 | JP15.2 54.61,35.56 v55.88,35.56 | v66.04,46.99 v66.04,50.8
I2C-SDA-LV  (via drill 0.51)
  Top 0.254: U1.27 59.76,14.04 58.42,12.7 50.8,12.7 v46.99,16.51 | R11.2 JP15.1 53.34,34.29 | 53.34,34.29 54.61,33.02 54.61,26.67 53.34,25.4 v46.99,25.4 | U2.27 57.22,63.43 64.77,55.88 v64.77,50.8 | U3.27 39.3,68.65 v41.91,66.04 | v38.1,57.15 38.1,49.53 39.37,48.26 v64.77,48.26 | 53.34,34.29 53.34,35.56 55.88,38.1 63.5,38.1 64.77,39.37 v64.77,45.72
  Bottom 0.254: v46.99,16.51 v46.99,25.4 | v38.1,57.15 38.1,62.23 v41.91,66.04 | v64.77,45.72 v64.77,48.26 v64.77,50.8
IMU-AUX0
  Top 0.254: U3.10 24.67,71.85 10.16,86.36 5.08,86.36 3.81,85.09 JP5.1
IMU-AUX1
  Top 0.254: U3.11 24.2,71.05 12.7,82.55 5.08,82.55 JP5.2
IMU-AUX2
  Top 0.254: U3.12 23.73,70.25 13.97,80.01 5.08,80.01 JP5.3
IMU-AUX3
  Top 0.254: U3.13 23.26,69.45 13.97,78.74 JP29.3
IMU-AUX4  (via drill 0.51)
  Top 0.254: U3.14 22.79,68.65 13.97,77.47 v12.7,77.47
  Bottom 0.254: v12.7,77.47 8.89,81.28 JP29.2
IMU-AX
  Top 0.254: U3.23 33.75,64.55 34.8,63.5 38.1,63.5 40.64,60.96 JP31.1 U$12.AX
IMU-AY
  Top 0.254: U3.24 34.55,65.14 37.73,65.14 JP31.2 U$12.AY
IMU-AZ
  Top 0.254: U3.25 36.04,66.19 37.95,66.19 41.91,62.23 44.45,62.23 45.72,60.96 JP31.3 U$12.AZ
IMU-GX  (via drill 0.51)
  Top 0.254: U3.22 32.95,64.33 34.29,62.99 v34.29,58.42 | U$12.XX4 JP31.5
  Bottom 0.254: U$12.XX4 50.8,55.88 49.53,54.61 38.1,54.61 v34.29,58.42
IMU-GY  (via drill 0.51)
  Top 0.254: U3.19 30.55,58.35 v35.56,53.34 | U$12.YX4 JP31.6
  Bottom 0.254: v35.56,53.34 50.16,53.34 U$12.YX4
IMU-GZ
  Top 0.254: U3.26 37.56,67.85 41.91,63.5 46.99,63.5 48.26,62.23 JP31.4 U$12.ZX4
IMU-SCL
  Top 0.254: JP20.1 R13.1 | JP20.1 29.21,87.63 27.94,88.9 JP21.1 | U3.1 42.39,74.14 43.18,74.93 JP20.1
IMU-SDA  (via drill 0.51)
  Top 0.254: R14.1 JP20.2 42.42,90.17 40.64,88.39 32.26,88.39 30.48,90.17 JP21.2 | U3.32 42.17,72.65 45.72,76.2 v45.72,85.09
  Bottom 0.254: v45.72,85.09 45.72,87.63 JP20.2
MOTOR-B  (via drill 0.51)
  Top 0.254: U1.1 69.59,17.52 v69.85,17.78 | JP8.1 78.74,38.1 77.47,36.83 v77.47,31.75
  Bottom 0.254: v69.85,17.78 71.12,17.78 72.39,19.05 72.39,22.86 77.47,27.94 v77.47,31.75
MOTOR-F
  Top 0.254: U1.15 58.96,27.84 59.69,28.57 70.48,28.57 71.12,29.21 71.12,44.45 72.39,45.72 JP6.1 88.9,44.45 88.9,34.29 90.17,33.02 92.71,33.02 93.98,31.75 93.98,16.51 ICSP1.4
MOTOR-L
  Top 0.254: U1.13 60.56,26.91 60.96,27.3 71.75,27.3 73.66,29.21 73.66,39.37 74.93,40.64 JP4.1
MOTOR-R
  Top 0.254: U1.14 59.76,27.38 60.33,27.94 71.12,27.94 72.39,29.21 72.39,41.91 73.66,43.18 JP7.1
N$1  (via drill 0.51)
  Top 0.254: S1.4 S1.3 60.66,31.62 R1.2 58.42,30.48 v57.15,29.21 | v59.69,19.05 61.36,17.38 U1.29 61.36,12.3 62.23,11.43 88.9,11.43 ICSP1.5
  Bottom 0.254: v59.69,19.05 57.15,21.59 v57.15,29.21
N$2  (via drill 0.51)
  Top 0.254: 71.68,58.98 S2.4 S2.3 79.73,56.87 v81.28,58.42 | 71.68,58.98 72.39,59.69 R2.2 | U2.29 58.82,64.37 60.96,62.23 68.43,62.23 71.68,58.98 | ICSP2.5 81.28,90.17 v82.55,88.9 | v82.55,86.36 83.19,85.72 88.27,85.72 88.9,85.09 88.9,70.36 88.39,69.85 v83.82,69.85
  Bottom 0.254: v82.55,86.36 v82.55,88.9 | v83.82,69.85 82.55,68.58 82.55,59.69 v81.28,58.42
N$3  (via drill 0.51)
  Top 0.254: S3.4 S3.3 21.59,53.9 | U3.29 40.75,70.25 v41.53,69.47 | v10.16,69.85 ICSP3.5 | v11.43,64.77 12.7,63.5 25.4,63.5 26.67,62.23 v26.67,58.42 | 21.59,53.9 28.5,53.9 v30.48,55.88 | 21.59,53.9 R3.2
  Bottom 0.254: v41.53,69.47 33.02,60.96 33.02,58.42 v30.48,55.88 27.94,58.42 v26.67,58.42 | v10.16,69.85 11.43,68.58 v11.43,64.77
N$4  (via drill 0.51)
  Top 0.254: U3.16 24.5,67.05 v24.13,66.67 | v20.32,66.04 7.62,66.04 ICSP3.1
  Bottom 0.254: v24.13,66.67 20.95,66.67 v20.32,66.04
N$5
  Top 0.254: U3.17 23.34,65.56 21.59,67.31 ICSP3.3
N$6
  Top 0.254: U2.16 55.62,90.16 57.66,92.2 68.07,92.2 70.1,90.17 ICSP2.1
N$7
  Top 0.254: U2.17 54.13,89.69 57.53,93.09 68.2,93.09 69.85,91.44 74.93,91.44 ICSP2.3
N$8
  Top 0.254: U1.16 58.16,23.12 58.42,22.86 63.5,22.86 64.77,24.13 78.11,24.13 78.74,23.5 85.72,23.5 86.36,22.86 86.36,19.05 87.63,17.78 ICSP1.1
N$9  (via drill 0.51)
  Top 0.254: U1.17 55.62,23.12 v54.61,24.13 | ICSP1.3 91.44,13.97 91.44,11.43 90.17,10.16 v54.61,10.16
  Bottom 0.254: v54.61,10.16 v54.61,24.13
N$10
  Top 0.254: JP3.1 24.13,22.86 D1.C
N$11
  Top 0.254: ICSP2.4 77.47,91.44 77.47,88.9 76.2,87.63 71.75,87.63 67.94,91.44 58.42,91.44 56.42,89.44 U2.15
N$12
  Top 0.254: U3.15 22.32,67.85 21.59,68.58 5.08,68.58 ICSP3.4
N$13
  Top 0.254: R4.2 87.5,90.3 87.63,90.17 LED1.A
N$14
  Top 0.254: U1.7 71.66,22.32 72.39,21.59 72.39,17.78 73.66,16.51 Q1.2 C2.1
N$15
  Top 0.254: U1.8 73.4,23.12 Q1.1 C1.1
N$16
  Top 0.254: U2.7 65.5,73.12 67.31,74.93 67.31,80.01 Q2.2 68.71,81.41 C4.1
N$17
  Top 0.254: U2.8 63.76,73.92 64.77,74.93 64.77,80.01 Q2.1 63.63,81.41 C3.1
N$18
  Top 0.254: U3.7 29.75,78.52 Q3.2 33.02,82.55 34.42,83.95 C6.1
N$19
  Top 0.254: U3.8 28.95,80.78 Q3.1 27.94,82.55 26.54,83.95 C5.1
N$20
  Top 0.254: LED2.C 87.63,7.62 86.36,8.89 81.28,8.89 80.01,7.62 | 80.01,7.62 JP16.1 | 80.01,7.62 78.74,8.89 62.23,8.89 60.96,7.62 Q4.3 58.42,5.08 56.59,6.91 SG1.-
N$21
  Top 0.254: R6.2 67.18,3.68 66.04,2.54 63.5,2.54 62.87,3.17 Q4.2
N$22
  Top 0.254: R5.2 84.96,6.48 87.63,3.81 LED2.A
N$23
  Top 0.254: R7.2 JP27.1
N$24
  Top 0.254: R8.2 JP27.2
N$25
  Top 0.254: R9.2 JP27.3
N$26
  Top 0.254: R10.2 77.34,6.48 JP16.2
N$27
  Top 0.254: R15.E 39.37,30.48 38.23,31.62 R16.1
N$28
  Top 0.254: LED3.A 3.58,25.63 3.81,25.4 3.94,25.53 R17.1
N$29
  Top 0.254: U7.8 81.64,79.09 83.82,81.28 JP9.1
N$30
  Top 0.254: U7.6 81.61,77.8 82.55,78.74 JP10.1
N$31
  Top 0.254: U7.4 82.25,76.5 82.55,76.2 JP11.1
N$32
  Top 0.254: U7.2 82.28,75.19 83.82,73.66 JP12.1
N$33
  Top 0.254: U7.15 77.14,77.8 77.47,77.47 77.47,73.66 80.01,71.12 JP13.1
N$34
  Top 0.254: U7.17 75.91,76.5 76.2,76.2 76.2,73.66 81.28,68.58 JP14.1
NAV-BEACON
  Top 0.254: U1.11 62.16,25.96 62.87,26.67 72.39,26.67 76.2,30.48 R9.1
NAV-LEFT
  Top 0.254: U1.9 63.76,25.02 64.14,25.4 R7.1
NAV-RIGHT
  Top 0.254: U1.10 62.96,25.5 63.5,26.04 73.03,26.04 74.93,27.94 R8.1
PWR_POS
  Top 0.254: U$9.CONN 24.13,3.81 JP1.2 21.28,6.04 21.59,6.35 D1.A
  Top 5.08: U$7.CONN U$8.CONN | U$9.CONN U$7.CONN | U$7.CONN U$10.CONN | U$10.CONN U$11.CONN | U$7.CONN U$11.CONN | U$9.CONN U$8.CONN | U$8.CONN U$11.CONN | U$9.CONN U$10.CONN
  Bottom 5.08: U$7.CONN U$8.CONN | U$7.CONN U$11.CONN | U$7.CONN U$10.CONN | U$9.CONN U$7.CONN | U$9.CONN U$8.CONN | U$10.CONN U$11.CONN | U$8.CONN U$11.CONN | U$9.CONN U$10.CONN
RECV-CH1
  Top 0.254: U7.18 72.03,75.84 71.12,74.93 71.12,69.85 67.31,66.04 62.23,66.04 61.44,66.83 U2.32
RECV-CH2
  Top 0.254: U2.1 68.32,68.32 69.85,69.85 69.85,76.2 70.8,77.14 U7.16
RECV-CH3
  Top 0.254: U2.2 67.85,69.12 68.58,69.85 68.58,77.47 69.56,78.44 U7.14
RECV-CH4
  Top 0.254: U2.9 61.22,78.35 59.05,80.52 59.05,86.11 60.58,87.63 68.71,87.63 72.39,83.95 72.39,80.01 72.66,79.75 U7.12
RECV-CH5  (via drill 0.51)
  Top 0.254: U7.5 79.06,77.14 78.74,77.47 v78.74,83.82 | U2.10 60.42,78.26 58.42,80.26 58.42,86.36 60.2,88.14 68.96,88.14 73.28,83.82 v74.93,83.82
  Bottom 0.254: v74.93,83.82 v78.74,83.82
RECV-CH6
  Top 0.254: U7.3 78.46,75.84 78.11,76.2 78.11,78.11 77.47,78.74 77.47,83.82 76.2,85.09 72.77,85.09 68.96,88.9 58.93,88.9 57.78,87.76 57.78,80.14 59.62,78.3 U2.11
RECV-SIG
  Top 0.254: U2.12 58.82,78.34 57.15,80.01 57.15,88.9 58.42,90.17 68.45,90.17 71.63,87 79.38,87 79.88,87.5 R4.1
RXD1  (via drill 0.51)
  Top 0.254: U1.30 62.16,14.04 v63.5,12.7
  Bottom 0.254: v63.5,12.7 63.5,13.97 66.04,16.51 66.04,17.78 69.85,21.59 69.85,22.86 74.93,27.94 74.93,46.99 76.2,48.26 86.36,48.26 87.63,49.53 JP30.2
RXD2
  Top 0.254: JP17.2 86.36,59.69 86.36,63.5 85.09,64.77 69.85,64.77 68.58,63.5 60.96,63.5 59.62,64.84 U2.30
RXD3  (via drill 0.51)
  Top 0.254: JP18.2 87.63,63.5 85.09,66.04 v72.39,66.04 | v46.99,66.04 41.98,71.05 U3.30 34.22,71.05 v33.02,69.85 | v19.05,78.74 19.05,87.63 16.51,90.17 12.7,90.17 JP19.2
  Bottom 0.254: v46.99,66.04 v72.39,66.04 | v33.02,69.85 31.75,69.85 25.4,76.2 21.59,76.2 v19.05,78.74
TXD1  (via drill 0.51)
  Top 0.254: U1.31 62.96,14.51 63.5,13.97 v66.04,13.97
  Bottom 0.254: v66.04,13.97 67.31,15.24 67.31,17.78 71.12,21.59 71.12,22.86 76.2,27.94 76.2,45.72 77.47,46.99 86.36,46.99 90.17,50.8 JP30.3
TXD2
  Top 0.254: JP17.3 88.9,59.69 88.9,63.5 85.09,67.31 71.12,67.31 68.58,64.77 60.96,64.77 60.42,65.31 U2.31
TXD3  (via drill 0.51)
  Top 0.254: JP18.3 90.17,63.5 85.72,67.94 73.03,67.94 v72.39,68.58 | v46.99,67.31 42.45,71.85 U3.31 33.75,71.85 v33.02,71.12 | v17.78,81.28 17.78,87.63 16.51,88.9 8.89,88.9 7.62,90.17 JP19.1
  Bottom 0.254: v72.39,68.58 71.12,67.31 v46.99,67.31 | v33.02,71.12 31.75,71.12 25.4,77.47 21.59,77.47 v17.78,81.28
VCC
  Top 0.254: R16.2 26.67,31.75 21.59,26.67 JP3.2 C17.+ 10.16,27.94 6.35,27.94 5.08,29.21 IC1.1

### Text on the board
tPlace: GPS | COMPASS | IMU-I2C | GND | TX | RX | GND | 3.3V | 3.3V | PLS | MODE | SCL | SDA | 3.3V | GND | SDA | ICSP2 | SCL | 1 | PWR | SIG | + | - | RECEIVER | 1 | 2 | IMU-AUX | 3 | Telemetry (3) | 4 | ICSP3 | 5 | 6 | Receiver (2) | RST3 | SER3 | 3V3 | RX | TX | GND | SER2 | By: | SER1 | Joe | RIGHT | Ferner | Quadcopter Rev2 | RST2 | BACK | FRONT | LEFT | FRONT | MOTORS | RIGHT | LEFT | BACK | RST1 | SIG | + | - | I2C | SDA | BCN | NAV | SCL | GND | R | L | + | - | BATADJ | Main (1) | ICSP1 | - | Power | + | + | 3.3V | 5V | GND | + | - | PWR | Battery | Warning